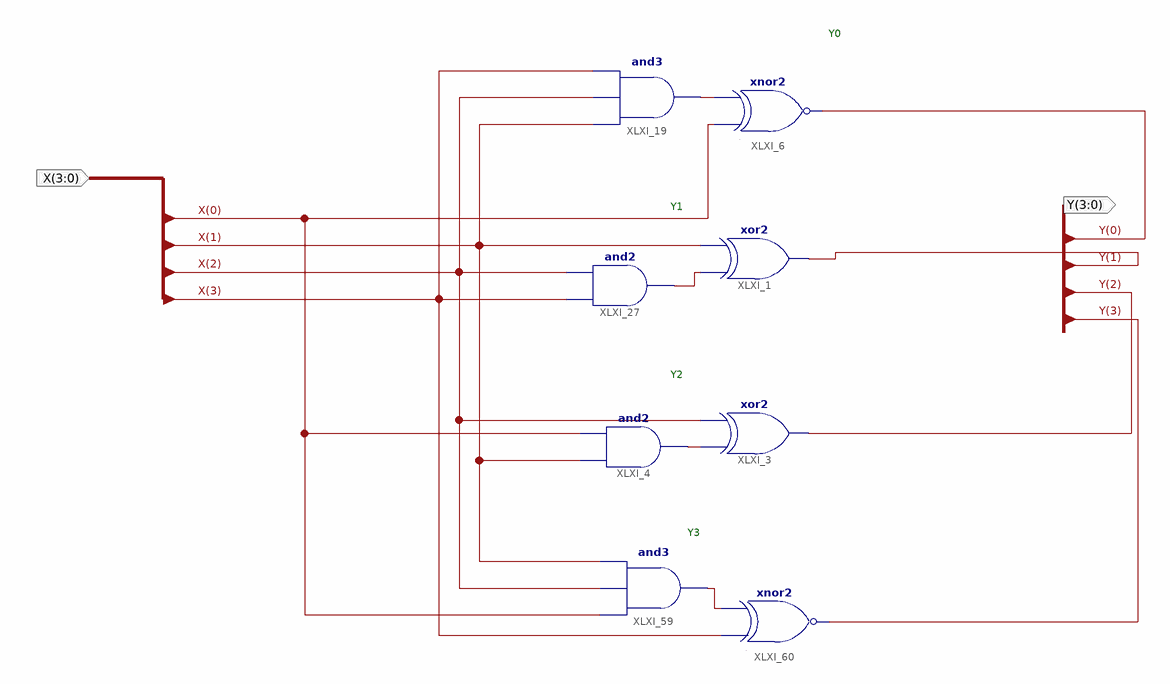
[diagram p0: schematic sheet 1]
// Xilinx ISE schematic schemat_.sch (xc9500xl) as structural Verilog: 8 symbols, 2 ports
module schemat_ (
  input  [3:0] X,
  output [3:0] Y
);

  wire XLXN_2, XLXN_8, XLXN_23, XLXN_61;

  and XLXI_27 (XLXN_23, X[3], X[2]);
  xor XLXI_1 (Y[1], XLXN_23, X[1]);
  xor XLXI_3 (Y[2], XLXN_2, X[2]);
  and XLXI_4 (XLXN_2, X[1], X[0]);
  and XLXI_19 (XLXN_8, X[1], X[2], X[3]);
  xnor XLXI_6 (Y[0], X[0], XLXN_8);
  and XLXI_59 (XLXN_61, X[0], X[2], X[1]);
  xnor XLXI_60 (Y[3], X[3], XLXN_61);

  // Notes on the sheet:
  //   Y0
  //   Y1
  //   Y2
  //   Y3
endmodule
